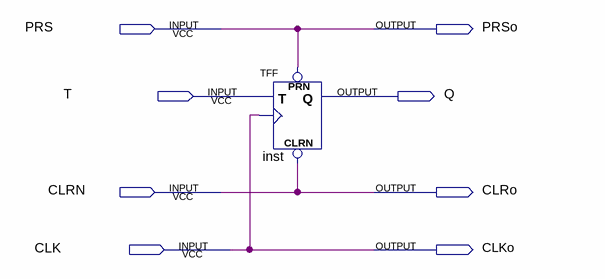
[diagram p0: schematic sheet]
// Quartus schematic td2.bdf as structural Verilog: 1 symbols, 8 pins
module td2 (
  input  PRS,
  input  T,
  input  CLRN,
  input  CLK,
  output PRSo,
  output Q,
  output CLRo,
  output CLKo
);

  TFF inst (.PRN(PRS), .CLRN(CLRN), .T(T), .CLK(CLK), .Q(Q));

  assign CLKo = CLK;
  assign CLRo = CLRN;
  assign PRSo = PRS;
endmodule
